# EasyEDA Pro project ProPrj_电容计量V2_2026-06-24.epro, schematic Schematic15_4
Board Name: Board1; Create Date: 2026-01-06; Page Name: P1; Project Name: 电容计量1; Schematic Name: Schematic5; Update Date: 2026-01-06; Page Size: A4; Version: V1.0
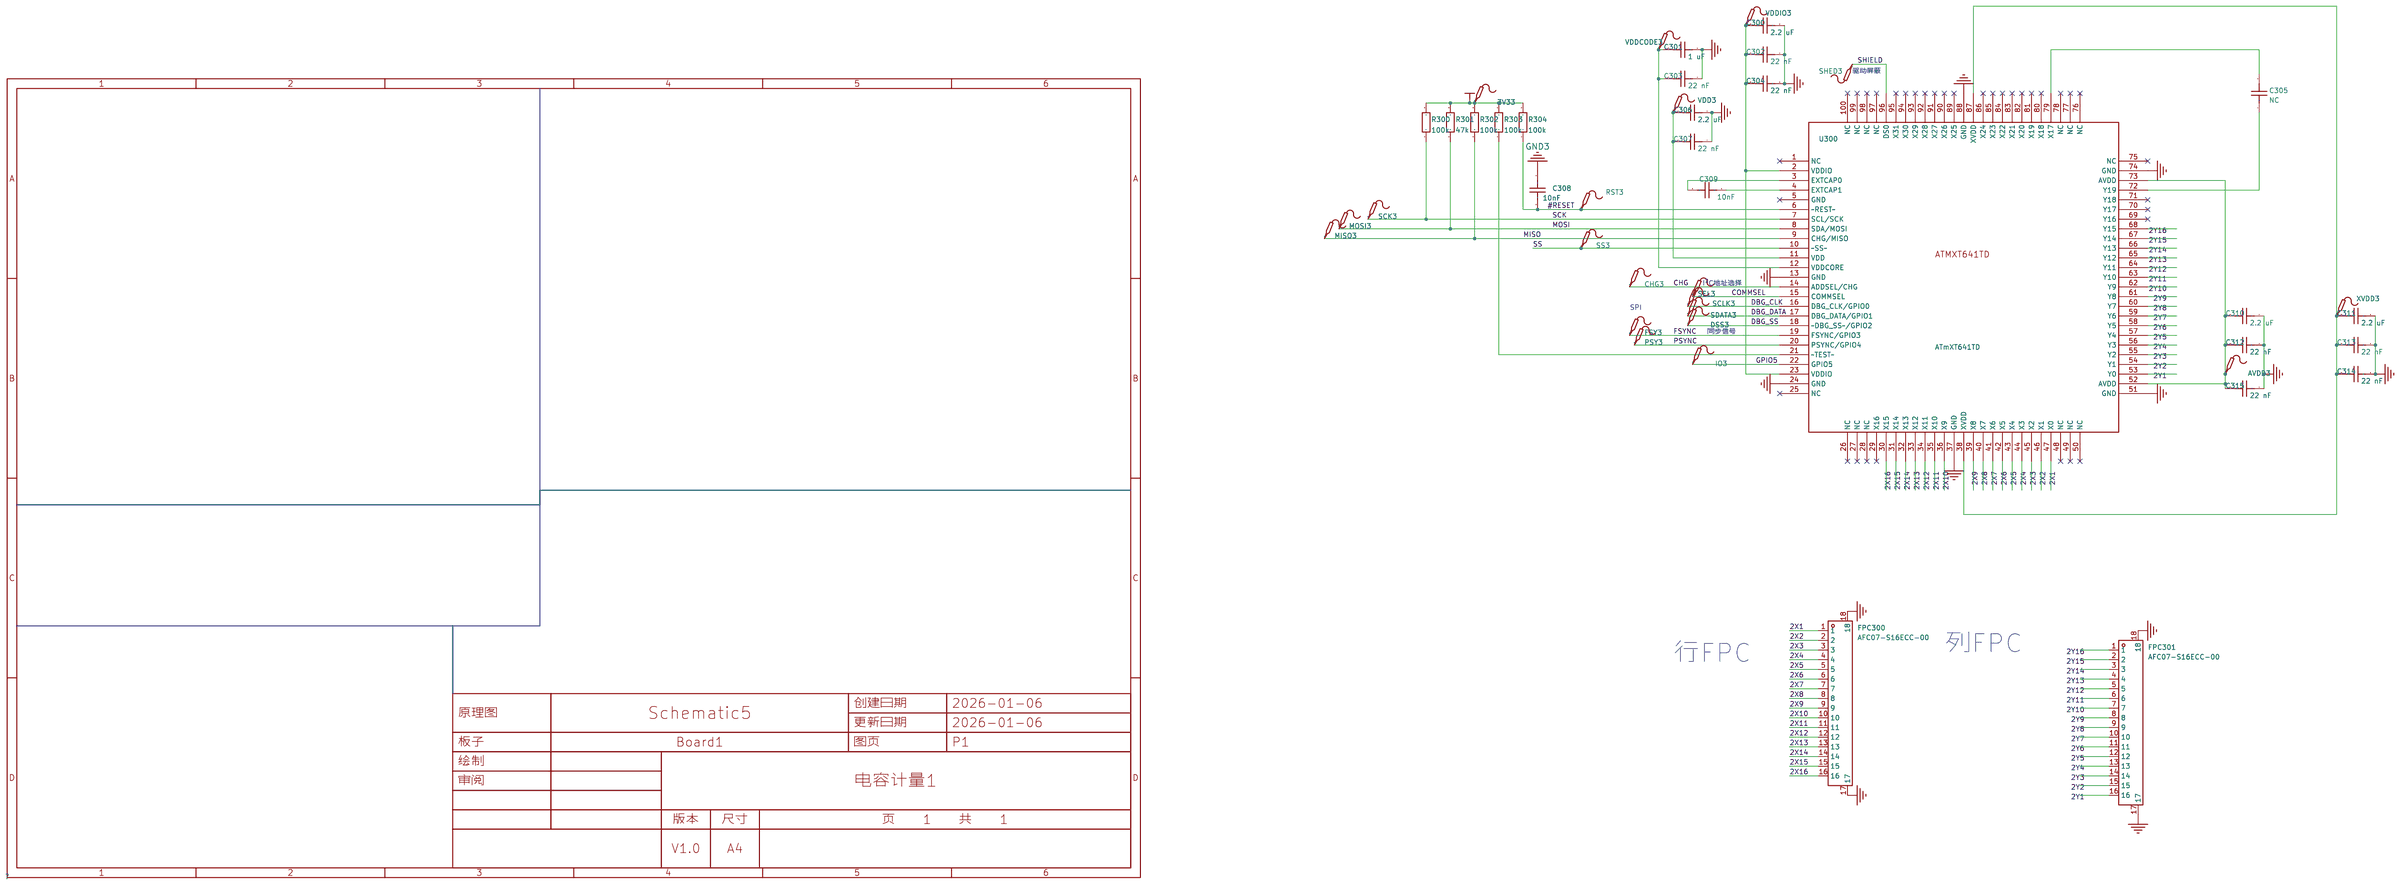
[diagram p3: schematic sheet]

## Parts
3V33  -  [Test-Point-0.5mm]
AVDD3  -  [Test-Point-0.5mm]
C300  2.2 uF  [C0402]
C301  1 uF  [C0402]
C302  22 nF  [C0402]
C303  22 nF  [C0402]
C304  22 nF  [C0402]
C305  NC  [C0402]
C306  2.2 uF  [C0402]
C307  22 nF  [C0402]
C308  10nF  [C0402]
C309  10nF  [C0402]
C310  2.2 uF  [C0402]
C311  2.2 uF  [C0402]
C312  22 nF  [C0402]
C313  22 nF  [C0402]
C314  22 nF  [C0402]
C315  22 nF  [C0402]
CHG3  -  [Test-Point-0.5mm]
DSS3  -  [Test-Point-0.5mm]
FPC300  AFC07-S16ECC-00  [FPC-SMD_16P-P0.50_AFC07-S16ECC-00]
FPC301  AFC07-S16ECC-00  [FPC-SMD_16P-P0.50_AFC07-S16ECC-00]
FSY3  -  [Test-Point-0.5mm]
IO3  -  [Test-Point-0.5mm]
MISO3  -  [Test-Point-0.5mm]
MOSI3  -  [Test-Point-0.5mm]
PSY3  -  [Test-Point-0.5mm]
R300  100k  [R0402]
R301  47k  [R0402]
R302  100k  [R0402]
R303  100k  [R0402]
R304  100k  [R0402]
RST3  -  [Test-Point-0.5mm]
SCK3  -  [Test-Point-0.5mm]
SCLK3  -  [Test-Point-0.5mm]
SDATA3  -  [Test-Point-0.5mm]
SEL3  -  [Test-Point-0.5mm]
SHED3  -  [Test-Point-0.5mm]
SS3  -  [Test-Point-0.5mm]
U300  ATmXT641TD  [ATMXT641TD]
VDD3  -  [Test-Point-0.5mm]
VDDCODE3  -  [Test-Point-0.5mm]
VDDIO3  -  [Test-Point-0.5mm]
XVDD3  -  [Test-Point-0.5mm]

## Library data of the parts
3V33 AVDD3 VDD3 VDDCODE3 VDDIO3 XVDD3 = Test-Point: Test Point 测试点
C300-C315 = CC0402KRX7R7BB104: 容值:100nF;精度:±10%;额定电压:16V;温度系数:X7R;; LCSC Part Name: 100nF ±10% 16V; Supplier Part: C60474; Manufacturer: YAGEO(国巨); Supplier Footprint: 0402; JLCPCB Part Class: Extended Part; Datasheet: https://atta.szlcsc.com/upload/public/pdf/source/20211223/9278FD768280B81DDBEF48FA36411A03.pdf; Supplier: LCSC; Tolerance: ±10%; Voltage Rated: 16V; Temperature Coefficient: X7R
CHG3 DSS3 FSY3 IO3 MISO3 MOSI3 PSY3 RST3 SCK3 SCLK3 SDATA3 SEL3 SHED3 SS3 = Test-Point: Test Point 测试点; Check: false
FPC300 FPC301 = AFC07-S16ECC-00: 锁定特性:抽屉式;触点类型:上接;触点数量:16P;间距:0.5mm;安装方式:卧贴;工作温度:-25℃~+85℃;; LCSC Part Name: 抽屉式 上接 P数:16P 间距:0.5mm; Supplier Part: C11088; Manufacturer: JS(钜硕电子); Supplier Footprint: SMD,P=0.5mm,卧贴; JLCPCB Part Class: Extended Part; Datasheet: https://item.szlcsc.com/datasheet/AFC07-S16ECC-00/11635.html; Supplier: LCSC; Locking Feature: 抽屉式; Contact Type: 上接; Number of Contacts: 16P; Pitch: 0.5mm; Mounting Type: 卧贴; FFC, FCB Thickness: 0.3mm; Height Above Board: 2mm; Contact Material: 磷青铜; Contact Plating: 锡; Operating Temperature: -25℃~+85℃; Rated Voltage (Max): 50V; Current Rating (Max): 400mA
R300-R304 = 0603WAF1002T5E: LCSC Part Name: 10KΩ(1002) ±1% 编带; Supplier Part: C25804; Manufacturer: UNI-ROYAL(厚声); Supplier Footprint: 0603; JLCPCB Part Class: Basic Part; Datasheet: https://atta.szlcsc.com/upload/public/pdf/source/20170920/C25804_1505901551523983377.pdf; Supplier: LCSC
U300 = ATmXT641TD

## Nets
3V33: 3V33.1 R300.2 R301.2 R302.2 R303.2 R304.2
GND3: C300.1 C301.1 C302.1 C303.1 C304.1 C306.1 C307.1 C308.1 C310.1 C311.1 C312.1 C313.1 C314.1 C315.1 FPC300.17 FPC300.18 FPC301.17 FPC301.18 U300.13(GND) U300.24(GND) U300.37(GND) U300.51(GND) U300.74(GND) U300.88(GND)
2X1: FPC300.1 U300.47(X0)
2X2: FPC300.2 U300.46(X1)
2X3: FPC300.3 U300.45(X2)
2X4: FPC300.4 U300.44(X3)
2X5: FPC300.5 U300.43(X4)
2X6: FPC300.6 U300.42(X5)
2X7: FPC300.7 U300.41(X6)
2X8: FPC300.8 U300.40(X7)
2X9: FPC300.9 U300.39(X8)
2X10: FPC300.10 U300.36(X9)
2X11: FPC300.11 U300.35(X10)
2X12: FPC300.12 U300.34(X11)
2X13: FPC300.13 U300.33(X12)
2X14: FPC300.14 U300.32(X13)
2X15: FPC300.15 U300.31(X14)
2X16: FPC300.16 U300.30(X15)
2Y1: FPC301.16 U300.53(Y0)
2Y2: FPC301.15 U300.54(Y1)
2Y3: FPC301.14 U300.55(Y2)
2Y4: FPC301.13 U300.56(Y3)
2Y5: FPC301.12 U300.57(Y4)
2Y6: FPC301.11 U300.58(Y5)
2Y7: FPC301.10 U300.59(Y6)
2Y8: FPC301.9 U300.60(Y7)
2Y9: FPC301.8 U300.61(Y8)
2Y10: FPC301.7 U300.62(Y9)
2Y11: FPC301.6 U300.63(Y10)
2Y12: FPC301.5 U300.64(Y11)
2Y13: FPC301.4 U300.65(Y12)
2Y14: FPC301.3 U300.66(Y13)
2Y15: FPC301.2 U300.67(Y14)
2Y16: FPC301.1 U300.68(Y15)
#RESET: C308.2 R304.1 RST3.1 U300.6(~REST~)
CHG: CHG3.1 U300.14(ADDSEL/CHG)
COMMSEL: SEL3.1 U300.15(COMMSEL)
DBG_CLK: SCLK3.1 U300.16(DBG_CLK/GPIO0)
DBG_DATA: SDATA3.1 U300.17(DBG_DATA/GPIO1)
DBG_SS: DSS3.1 U300.18(~DBG_SS~/GPIO2)
FSYNC: FSY3.1 U300.19(FSYNC/GPIO3)
GPIO5: IO3.1 U300.22(GPIO5)
MISO: MISO3.1 R302.1 U300.9(CHG/MISO)
MOSI: MOSI3.1 R301.1 U300.8(SDA/MOSI)
PSYNC: PSY3.1 U300.20(PSYNC/GPIO4)
SCK: R300.1 SCK3.1 U300.7(SCL/SCK)
SHIELD: SHED3.1 U300.96(DS0)
SS: SS3.1 U300.10(~SS~)
$1N750: C300.2 C302.2 C304.2 U300.2(VDDIO) U300.23(VDDIO) VDDIO3.1
$1N751: C301.2 C303.2 U300.12(VDDCORE) VDDCODE3.1
$1N754: C306.2 C307.2 U300.11(VDD) VDD3.1
$1N755: C311.2 C313.2 C314.2 U300.38(XVDD) U300.87(XVDD) XVDD3.1
$1N759: AVDD3.1 C310.2 C312.2 C315.2 U300.52(AVDD) U300.73(AVDD)
$1N771: C309.1 U300.4(EXTCAP1)
$1N772: C305.1 U300.72(Y19)
$1N773: C305.2 U300.79(X17)
$1N775: R303.1 U300.21(~TEST~)
$1N786: C309.2 U300.3(EXTCAP0)

Not connected (* = marked no-connect by the designer): U300 1(NC)* 5(GND)* 25(NC)* 26(NC)* 27(NC)* 28(NC)* 29(X16)* 48(NC)* 49(NC)* 50(NC)* 69(Y16)* 70(Y17)* 71(Y18)* 75(NC)* 76(NC)* 77(NC)* 78(NC)* 80(X18)* 81(X19)* 82(X20)* 83(X21)* 84(X22)* 85(X23)* 86(X24)* 89(X25)* 90(X26)* 91(X27)* 92(X28)* 93(X29)* 94(X30)* 95(X31)* 97(NC)* 98(NC)* 99(NC)* 100(NC)*

## Notes on the sheet
- 驱动屏蔽
- I²C地址选择
- SPI
- 同步信号
- 列FPC
- 行FPC
